# Altium schematic sheet RF_Transceiver_LM6002D_Power.SchDoc
size A4; DocumentNumber: 26; SheetNumber: 26; SheetTotal: 47
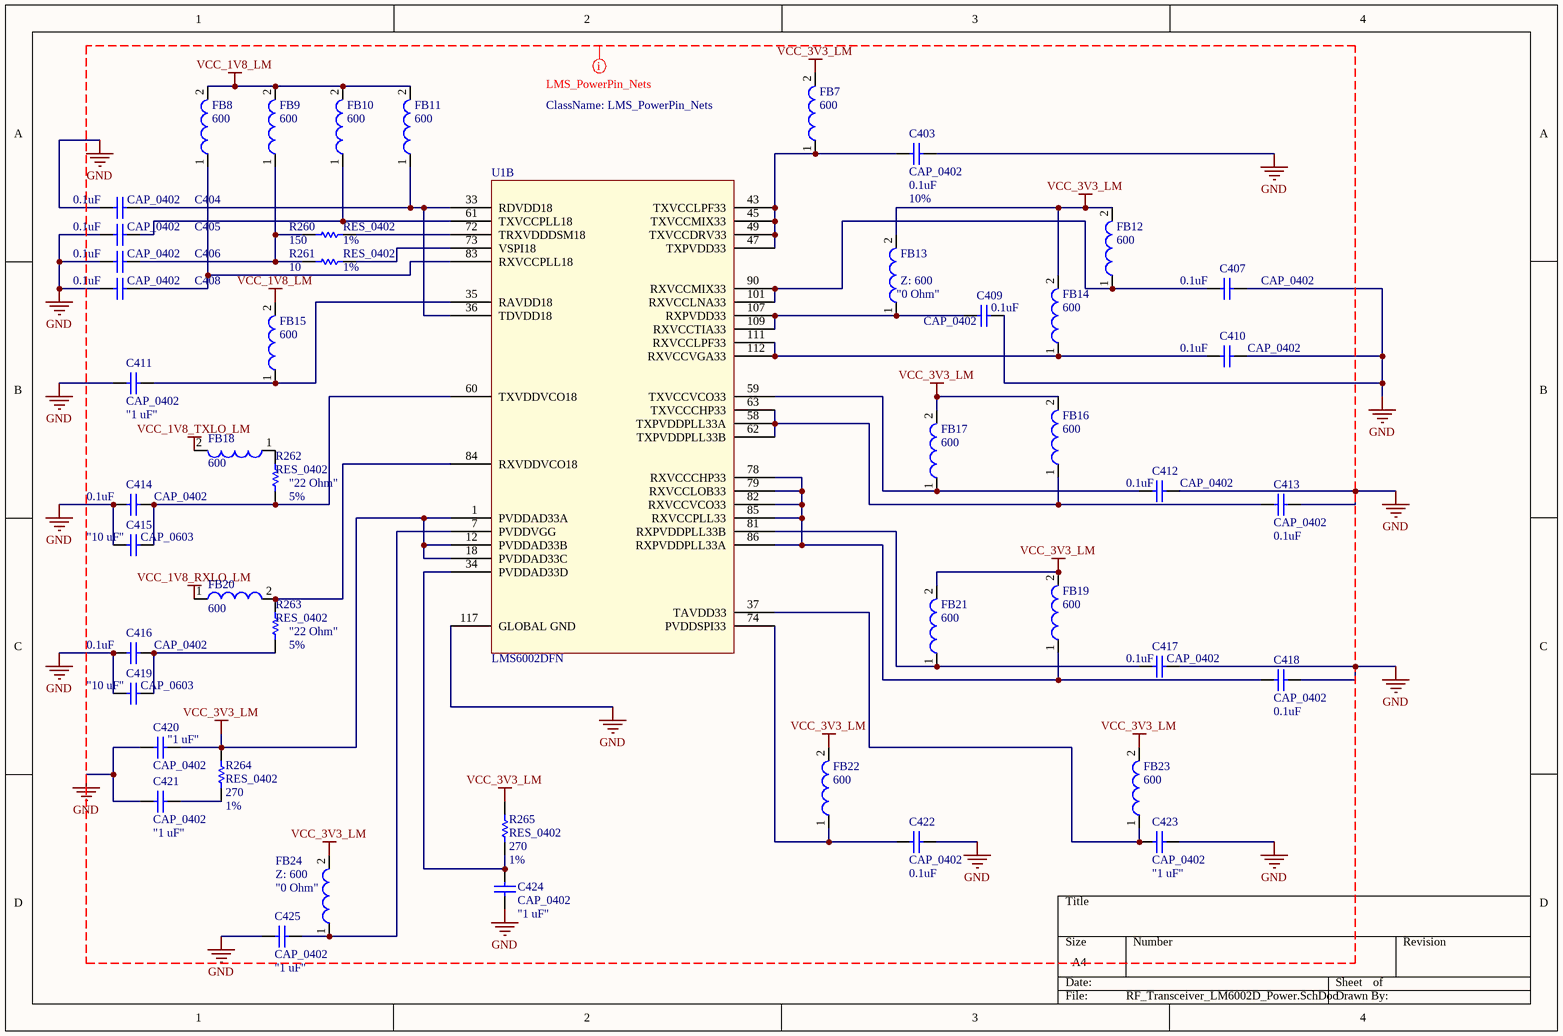
[diagram p0: RF_Transceiver_LM6002D_Power.SchDoc]

## Parts
C403  CAP_0402  value 0.1uF  Tolerance: 10%  [CAPC0402(1005)60_N]
C404  CAP_0402  value 0.1uF  [CAPC0402(1005)60_N]
C405  CAP_0402  value 0.1uF  [CAPC0402(1005)60_N]
C406  CAP_0402  value 0.1uF  [CAPC0402(1005)60_N]
C407  CAP_0402  value 0.1uF  [CAPC0402(1005)60_N]
C408  CAP_0402  value 0.1uF  [CAPC0402(1005)60_N]
C409  CAP_0402  value 0.1uF  [CAPC0402(1005)60_N]
C410  CAP_0402  value 0.1uF  [CAPC0402(1005)60_N]
C411  CAP_0402  value "1 uF"  [CAPC0402(1005)60_N]
C412  CAP_0402  value 0.1uF  [CAPC0402(1005)60_N]
C413  CAP_0402  value 0.1uF  [CAPC0402(1005)60_N]
C414  CAP_0402  value 0.1uF  [CAPC0402(1005)60_N]
C415  CAP_0603  value "10 uF"  [CAPC0603(1608)100_N]
C416  CAP_0402  value 0.1uF  [CAPC0402(1005)60_N]
C417  CAP_0402  value 0.1uF  [CAPC0402(1005)60_N]
C418  CAP_0402  value 0.1uF  [CAPC0402(1005)60_N]
C419  CAP_0603  value "10 uF"  [CAPC0603(1608)100_N]
C420  CAP_0402  value "1 uF"  [CAPC0402(1005)60_N]
C421  CAP_0402  value "1 uF"  [CAPC0402(1005)60_N]
C422  CAP_0402  value 0.1uF  [CAPC0402(1005)60_N]
C423  CAP_0402  value "1 uF"  [CAPC0402(1005)60_N]
C424  CAP_0402  value "1 uF"  [CAPC0402(1005)60_N]
C425  CAP_0402  value "1 uF"  [CAPC0402(1005)60_N]
FB7  Z: 600  [Inductor0402(1005)]  (hidden comment: FerriteBead)
FB8  Z: 600  [Inductor0402(1005)]  (hidden comment: FerriteBead)
FB9  Z: 600  [Inductor0402(1005)]  (hidden comment: FerriteBead)
FB10  Z: 600  [Inductor0402(1005)]  (hidden comment: FerriteBead)
FB11  Z: 600  [Inductor0402(1005)]  (hidden comment: FerriteBead)
FB12  Z: 600  [Inductor0402(1005)]  (hidden comment: FerriteBead)
FB13  value "0 Ohm"  Z: 600  [Inductor0402(1005)]  (hidden comment: FerriteBead)
FB14  Z: 600  [Inductor0402(1005)]  (hidden comment: FerriteBead)
FB15  Z: 600  [Inductor0402(1005)]  (hidden comment: FerriteBead)
FB16  Z: 600  [Inductor0402(1005)]  (hidden comment: FerriteBead)
FB17  Z: 600  [Inductor0402(1005)]  (hidden comment: FerriteBead)
FB18  Z: 600  [Inductor0402(1005)]  (hidden comment: FerriteBead)
FB19  Z: 600  [Inductor0402(1005)]  (hidden comment: FerriteBead)
FB20  Z: 600  [Inductor0402(1005)]  (hidden comment: FerriteBead)
FB21  Z: 600  [Inductor0402(1005)]  (hidden comment: FerriteBead)
FB22  Z: 600  [Inductor0402(1005)]  (hidden comment: FerriteBead)
FB23  Z: 600  [Inductor0402(1005)]  (hidden comment: FerriteBead)
FB24  value "0 Ohm"  Z: 600  [Inductor0402(1005)]  (hidden comment: FerriteBead)
R260  RES_0402  value 150  Tolerance: 1%  [RESC0402(1005)_N]
R261  RES_0402  value 10  Tolerance: 1%  [RESC0402(1005)_N]
R262  RES_0402  value "22 Ohm"  Tolerance: 5%  [RESC0402(1005)_N]
R263  RES_0402  value "22 Ohm"  Tolerance: 5%  [RESC0402(1005)_N]
R264  RES_0402  value 270  Tolerance: 1%  [RESC0402(1005)_N]
R265  RES_0402  value 270  Tolerance: 1%  [RESC0402(1005)_N]
U1  LMS6002DFN  [RF_Transceiver_LimeMicro_LMS6002D_DQFN-116]  (part B of 2)

## Nets
GND: C403.1 C404.2 C405.2 C406.2 C407.1 C408.2 C409.1 C410.1 C411.1 C412.1 C413.1 C414.2 C415.1 C416.2 C417.1 C418.1 C419.1 C420.1 C421.1 C422.1 C423.2 C424.1 C425.1 U1.117(GLOBAL_GND)
VCC_1V8_LM: FB8.2 FB9.2 FB10.2 FB11.2 FB15.2
VCC_1V8_RXLO_LM: FB20.1
VCC_1V8_TXLO_LM: FB18.2
VCC_3V3_LM: C420.2 FB7.2 FB12.2 FB13.2 FB14.2 FB16.2 FB17.2 FB19.2 FB21.2 FB22.2 FB23.2 FB24.2 R264.2 R265.1 U1.1(PVDDAD33A) U1.12(PVDDAD33B) U1.18(PVDDAD33C)
NetC403_2: C403.2 FB7.1 U1.43(TXVCCLPF33) U1.45(TXVCCMIX33) U1.47(TXPVDD33) U1.49(TXVCCDRV33)
NetC404_1: C404.1 FB11.1 U1.33(RDVDD18) U1.36(TDVDD18)
NetC405_1: C405.1 FB10.1 U1.61(TXVCCPLL18)
NetC406_1: C406.1 FB9.1 R260.1 R261.1
NetC407_2: C407.2 FB12.1 U1.90(RXVCCMIX33) U1.101(RXVCCLNA33)
NetC408_1: C408.1 FB8.1 U1.83(RXVCCPLL18)
NetC409_2: C409.2 FB13.1 U1.107(RXPVDD33) U1.109(RXVCCTIA33)
NetC410_2: C410.2 FB14.1 U1.111(RXVCCLPF33) U1.112(RXVCCVGA33)
NetC411_2: C411.2 FB15.1 U1.35(RAVDD18)
NetC412_2: C412.2 FB17.1 U1.59(TXVCCVCO33)
NetC413_2: C413.2 FB16.1 U1.58(TXPVDDPLL33A) U1.62(TXPVDDPLL33B) U1.63(TXVCCCHP33)
NetC414_1: C414.1 C415.2 R262.1 U1.60(TXVDDVCO18)
NetC416_1: C416.1 C419.2 R263.1
NetC417_2: C417.2 FB21.1 U1.81(RXPVDDPLL33B)
NetC418_2: C418.2 FB19.1 U1.78(RXVCCCHP33) U1.79(RXVCCLOB33) U1.82(RXVCCVCO33) U1.85(RXVCCPLL33) U1.86(RXPVDDPLL33A)
NetC421_2: C421.2 R264.1
NetC422_2: C422.2 FB22.1 U1.74(PVDDSPI33)
NetC423_1: C423.1 FB23.1 U1.37(TAVDD33)
NetC424_2: C424.2 R265.2 U1.34(PVDDAD33D)
NetC425_2: C425.2 FB24.1 U1.7(PVDDVGG)
NetFB18_1: FB18.1 R262.2
NetFB20_2: FB20.2 R263.2 U1.84(RXVDDVCO18)
NetR260_2: R260.2 U1.72(TRXVDDDSM18)
NetR261_2: R261.2 U1.73(VSPI18)

## Layout directives
net class LMS_PowerPin_Nets: GND, VCC_1V8_LM, VCC_1V8_RXLO_LM, VCC_1V8_TXLO_LM, VCC_3V3_LM

## Library data of the parts
C403-C410 C412-C414 C416-C418 C422 = C1005X5R0J104K: 0.1uf, ceramic, 10%, 6.3V, X5R, 0402; Manufacturer: TDK Corporation; Part Number: C1005X5R0J104K
  C404-C410 C412-C414 C416-C418 C422: Tolerance: 10%
C411 C420 C421 C423-C425 = "MCCA000506": C 1 uF 10V 0402 X5R; Manufacturer: MULTICOMP; Tolerance: *; Part Number: "MCCA000506"; Footprint Ref: CAPC0402(1005)60_N; Library Ref: CAP_0402
C415 C419 = "MCCA000517": C 10 uF 6.3 V 0603 X5R; Manufacturer: Multicomp; Tolerance: *; Part Number: "MCCA000517"; Footprint Ref: CAPC0603(1608)100_N; Library Ref: CAP_0603
FB7-FB12 FB14-FB23 = "MMZ1005S601C": Ferrite 300mA 600ohm 0402; Manufacturer: TDK; Value: "0 Ohm"; R: *; Current: *; Part Number: "MMZ1005S601C"
FB13 FB24 = "MMZ1005S601C": Ferrite 300mA 600ohm 0402; Manufacturer: TDK; R: *; Current: *; Part Number: "MMZ1005S601C"; Footprint Ref: Inductor0402(1005); Library Ref: FerriteBead
R260 = ERJ-2RKF1500X: RES 150 OHM 1/10W 1% 0402 SMD; Manufacturer: Panasonic Electronic Components; Part Number: ERJ-2RKF1500X
R261 = ERJ-2RKF10R0X: RES 10.0 OHM 1/10W 1% 0402 SMD; Manufacturer: Panasonic Electronic Components; Part Number: ERJ-2RKF10R0X
R262 R263 = "RC0402JR-0722RL": R 22 Ohm 5% 63mW 0402; Manufacturer: YAGEO; Part Number: "RC0402JR-0722RL"; Footprint Ref: RESC0402(1005)_N; Library Ref: RES_0402
R264 R265 = ERJ-2RKF2700X: RES 270 OHM 1/10W 1% 0402 SMD; Manufacturer: Panasonic Electronic Components; Part Number: ERJ-2RKF2700X
U1 = LMS6002DFN: RF Transceiver LMS6002D, 120 pin DQFN package, 1.8V and 3.3V; Manufacturer: Lime Micro; Part Number: LMS6002DFN